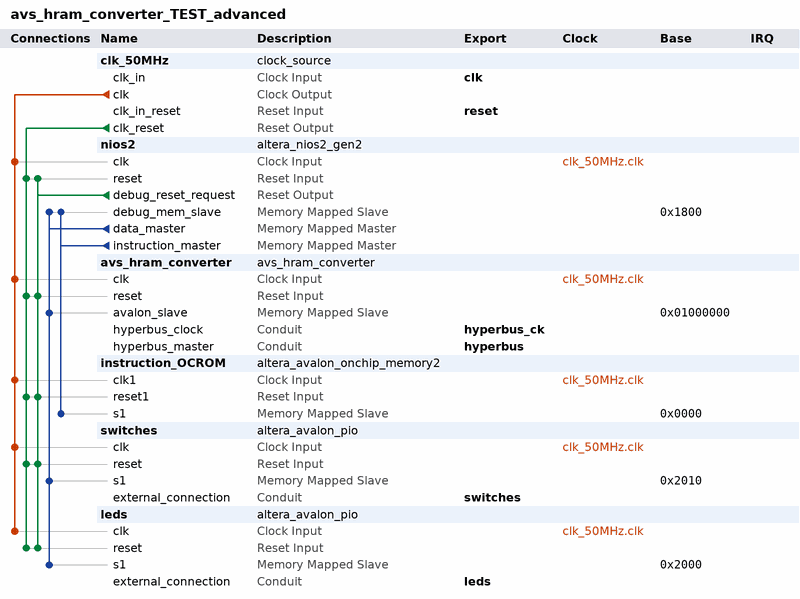
[diagram p0: system contents]
# Platform Designer (Qsys) system avs_hram_converter_TEST_advanced, Cyclone 10 LP 10CL006YE144A7G
# Parameters at their usual value, and those the tool derives, are not listed.
package require -exact qsys 22.1
create_system avs_hram_converter_TEST_advanced
set_project_property DEVICE_FAMILY {Cyclone 10 LP}
set_project_property DEVICE 10CL006YE144A7G

add_instance clk_50MHz clock_source 22.1
set_instance_parameter_value clk_50MHz clockFrequency 50000000

add_instance nios2 altera_nios2_gen2 22.1
set_instance_parameter_value nios2 dcache_size 2048
set_instance_parameter_value nios2 exceptionSlave instruction_OCROM.s1
set_instance_parameter_value nios2 icache_size 4096
set_instance_parameter_value nios2 impl Fast
set_instance_parameter_value nios2 resetSlave instruction_OCROM.s1

add_instance avs_hram_converter avs_hram_converter 1.0

add_instance instruction_OCROM altera_avalon_onchip_memory2 22.1
set_instance_parameter_value instruction_OCROM dataWidth 16
set_instance_parameter_value instruction_OCROM dualPort false
set_instance_parameter_value instruction_OCROM initMemContent true
set_instance_parameter_value instruction_OCROM initializationFileName /home/andrea/Documents/Tesi_287628/287628/hyperram_system/SBT_workspace/avs_hram_converter_TEST_advanced/mem_init/avs_hram_converter_TEST_advanced_instruction_OCROM.hex
set_instance_parameter_value instruction_OCROM memorySize 4096
set_instance_parameter_value instruction_OCROM useNonDefaultInitFile true
set_instance_parameter_value instruction_OCROM writable false

add_instance switches altera_avalon_pio 22.1
set_instance_parameter_value switches direction Input
set_instance_parameter_value switches width 4

add_instance leds altera_avalon_pio 22.1
set_instance_parameter_value leds direction Output
set_instance_parameter_value leds width 4

# connections
add_connection clk_50MHz.clk avs_hram_converter.clk clock
add_connection clk_50MHz.clk instruction_OCROM.clk1 clock
add_connection clk_50MHz.clk leds.clk clock
add_connection clk_50MHz.clk nios2.clk clock
add_connection clk_50MHz.clk switches.clk clock
add_connection clk_50MHz.clk_reset avs_hram_converter.reset reset
add_connection clk_50MHz.clk_reset instruction_OCROM.reset1 reset
add_connection clk_50MHz.clk_reset leds.reset reset
add_connection clk_50MHz.clk_reset nios2.reset reset
add_connection clk_50MHz.clk_reset switches.reset reset
add_connection nios2.debug_reset_request avs_hram_converter.reset reset
add_connection nios2.debug_reset_request instruction_OCROM.reset1 reset
add_connection nios2.debug_reset_request leds.reset reset
add_connection nios2.debug_reset_request nios2.reset reset
add_connection nios2.debug_reset_request switches.reset reset
add_connection nios2.data_master avs_hram_converter.avalon_slave avalon
set_connection_parameter_value nios2.data_master/avs_hram_converter.avalon_slave baseAddress 0x01000000
add_connection nios2.data_master leds.s1 avalon
set_connection_parameter_value nios2.data_master/leds.s1 baseAddress 0x2000
add_connection nios2.data_master nios2.debug_mem_slave avalon
set_connection_parameter_value nios2.data_master/nios2.debug_mem_slave baseAddress 0x1800
add_connection nios2.data_master switches.s1 avalon
set_connection_parameter_value nios2.data_master/switches.s1 baseAddress 0x2010
add_connection nios2.instruction_master instruction_OCROM.s1 avalon
set_connection_parameter_value nios2.instruction_master/instruction_OCROM.s1 baseAddress 0x0000
add_connection nios2.instruction_master nios2.debug_mem_slave avalon
set_connection_parameter_value nios2.instruction_master/nios2.debug_mem_slave baseAddress 0x1800

# exported interfaces
add_interface clk clock sink
set_interface_property clk EXPORT_OF clk_50MHz.clk_in
add_interface hyperbus conduit end
set_interface_property hyperbus EXPORT_OF avs_hram_converter.hyperbus_master
add_interface hyperbus_ck conduit end
set_interface_property hyperbus_ck EXPORT_OF avs_hram_converter.hyperbus_clock
add_interface leds conduit end
set_interface_property leds EXPORT_OF leds.external_connection
add_interface reset reset sink
set_interface_property reset EXPORT_OF clk_50MHz.clk_in_reset
add_interface switches conduit end
set_interface_property switches EXPORT_OF switches.external_connection

set_interconnect_requirement {$system} qsys_mm.clockCrossingAdapter HANDSHAKE
set_interconnect_requirement {$system} qsys_mm.enableEccProtection FALSE
set_interconnect_requirement {$system} qsys_mm.insertDefaultSlave FALSE
set_interconnect_requirement {$system} qsys_mm.maxAdditionalLatency 1

save_system avs_hram_converter_TEST_advanced.qsys
